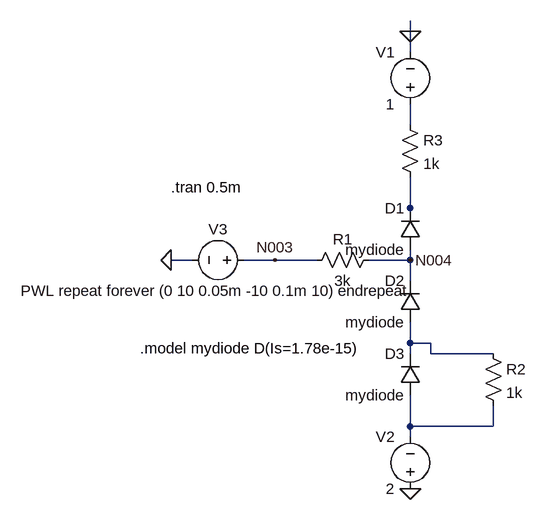
[diagram p0: schematic Draft11.asc]
Draft11.asc, the LTspice schematic file:
Version 4
SHEET 1 880 768
WIRE 560 48 560 32
WIRE 560 80 560 48
WIRE 560 192 560 160
WIRE 560 320 560 272
WIRE 560 336 560 320
WIRE 224 400 192 400
WIRE 352 400 304 400
WIRE 416 400 352 400
WIRE 560 400 560 384
WIRE 560 400 496 400
WIRE 560 432 560 400
WIRE 560 528 560 496
WIRE 592 528 560 528
WIRE 560 544 560 528
WIRE 592 544 592 528
WIRE 688 544 592 544
WIRE 560 656 560 608
WIRE 688 656 688 624
WIRE 688 656 560 656
WIRE 560 672 560 656
FLAG 192 400 0
FLAG 560 48 0
FLAG 560 752 0
FLAG 352 400 N003
FLAG 560 400 N004
SYMBOL res 512 384 R90
WINDOW 0 0 56 VBottom 2
WINDOW 3 32 56 VTop 2
SYMATTR InstName R1
SYMATTR Value 3k
SYMBOL diode 576 384 R180
WINDOW 0 24 64 Left 2
WINDOW 3 24 0 Left 2
SYMATTR InstName D1
SYMATTR Value mydiode
SYMBOL diode 576 496 R180
WINDOW 0 24 64 Left 2
WINDOW 3 24 0 Left 2
SYMATTR InstName D2
SYMATTR Value mydiode
SYMBOL diode 576 608 R180
WINDOW 0 24 64 Left 2
WINDOW 3 24 0 Left 2
SYMATTR InstName D3
SYMATTR Value mydiode
SYMBOL voltage 560 176 R180
WINDOW 0 24 96 Left 2
WINDOW 3 24 16 Left 2
SYMATTR InstName V1
SYMATTR Value 1
SYMBOL voltage 560 768 R180
WINDOW 0 24 96 Left 2
WINDOW 3 24 16 Left 2
SYMATTR InstName V2
SYMATTR Value 2
SYMBOL res 672 528 R0
SYMATTR InstName R2
SYMATTR Value 1k
SYMBOL res 544 176 R0
SYMATTR InstName R3
SYMATTR Value 1k
SYMBOL voltage 320 400 R90
WINDOW 0 -32 56 VBottom 2
WINDOW 3 32 56 VTop 2
SYMATTR InstName V3
SYMATTR Value PWL repeat forever (0 10 0.05m -10 0.1m 10) endrepeat
TEXT 144 536 Left 2 !.model mydiode D(Is=1.78e-15)
TEXT 192 288 Left 2 !.tran 0.5m

The netlist it stands for:
* Draft11.asc
R1 N004 N003 3k
D1 N004 N002 mydiode
D2 N005 N004 mydiode
D3 N006 N005 mydiode
V1 N001 0 1
V2 0 N006 2
R2 N005 N006 1k
R3 N001 N002 1k
V3 N003 0 PWL repeat forever (0 10 0.05m -10 0.1m 10) endrepeat
.model D D
.lib standard.dio
.model mydiode D(Is=1.78e-15)
.tran 0.5m
.backanno
.end